# Altium schematic sheet U SIM.SchDoc
size C; SheetNumber: 1; SheetTotal: 4
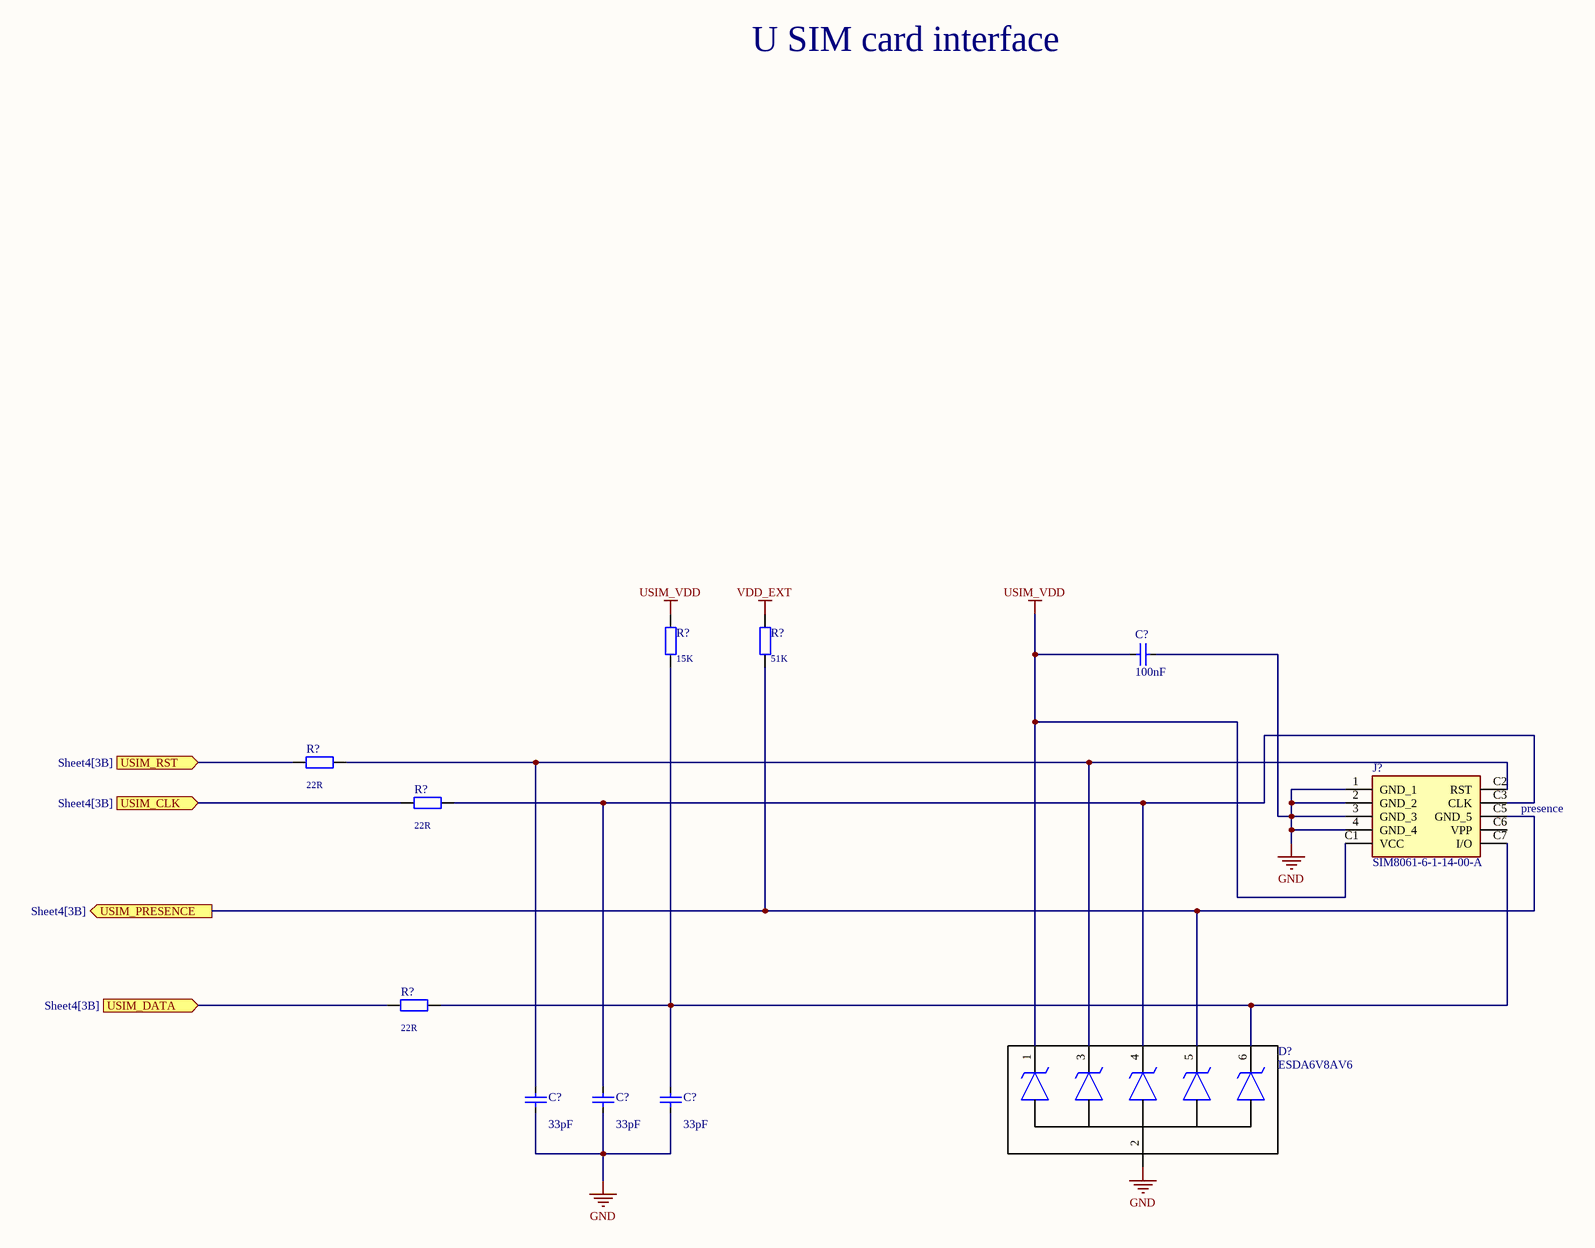
[diagram p0: U SIM.SchDoc]

## Parts
(Parts that share a designator on the sheet are numbered #1, #2 ... from top to bottom, then left to right.)
C?#1  value 100nF  [CAPC1608X09N]  (hidden comment: C)
C?#2  value 33pF  [CAPC1608X09N]  (hidden comment: C)
C?#3  value 33pF  [CAPC1608X09N]  (hidden comment: C)
C?#4  value 33pF  [CAPC1608X09N]  (hidden comment: C)
D?  ESDA6V8AV6  [SOTFL50P160X60-6N]
J?  SIM8061-6-1-14-00-A  [SIM8061611400A]
R?#1  value 15K  [RESC1005X04N]  (hidden comment: R)
R?#2  value 51K  [RESC1005X04N]  (hidden comment: R)
R?#3  value 22R  [RESC1005X04N]  (hidden comment: R)
R?#4  value 22R  [RESC1005X04N]  (hidden comment: R)
R?#5  value 22R  [RESC1005X04N]  (hidden comment: R)

## Ports
USIM_CLK (in, see Sheet4[3B]), USIM_DATA (in, see Sheet4[3B]), USIM_PRESENCE (out, see Sheet4[3B]), USIM_RST (in, see Sheet4[3B])

## Nets
GND: C?#1.2 C?#2.1 C?#3.1 C?#4.1 D?.2 J?.1(GND_1) J?.2(GND_2) J?.3(GND_3) J?.4(GND_4)
USIM_VDD: C?#1.1 D?.1 J?.C1(VCC) R?#1.2
VDD_EXT: R?#2.2
USIM_CLK: R?#4.1 ; port USIM_CLK
USIM_DATA: R?#5.1 ; port USIM_DATA
USIM_PRESENCE: D?.5 J?.C5(GND_5) R?#2.1 ; port USIM_PRESENCE
USIM_RST: R?#3.1 ; port USIM_RST
NetC?#2_2: C?#2.2 D?.3 J?.C2(RST) R?#3.2
NetC?#3_2: C?#3.2 D?.4 J?.C3(CLK) R?#4.2
NetC?#4_2: C?#4.2 D?.6 J?.C7(I/O) R?#1.1 R?#5.2

Not connected (* = marked no-connect by the designer): J? C6(VPP)

## Notes on the sheet
- U SIM card interface
- (near J?) presence

## Library data of the parts
D? = ESDA6V8AV6: TVS Diode (Bi-directional); Manufacturer_Name: Will Semiconductor; Datasheet Link: http://www.chinesechip.com/files/2015-06/c6e5fabb-2b46-4fb6-8cff-c88a4d044cb1.pdf; Height: 0.6mm; Manufacturer_Part_Number: ESDA6V8AV6
J? = SIM8061-6-1-14-00-A: Connector; Manufacturer_Name: GCT (GLOBAL CONNECTOR TECHNOLOGY); Datasheet Link: https://gct.co/connector/sim8061; Height: 1.58mm; Manufacturer_Part_Number: SIM8061-6-1-14-00-A; Mouser Part Number: 640-SIM8061611400A; Mouser Price/Stock: https://www.mouser.co.uk/ProductDetail/GCT/SIM8061-6-1-14-00-A?qs=%252BHhoWzUJg4JGbTNvJVYngw%3D%3D
C?#1-C?#4 = C: MPN: *; Link: *
R?#1-R?#5 = R: MPN: *; Link: *